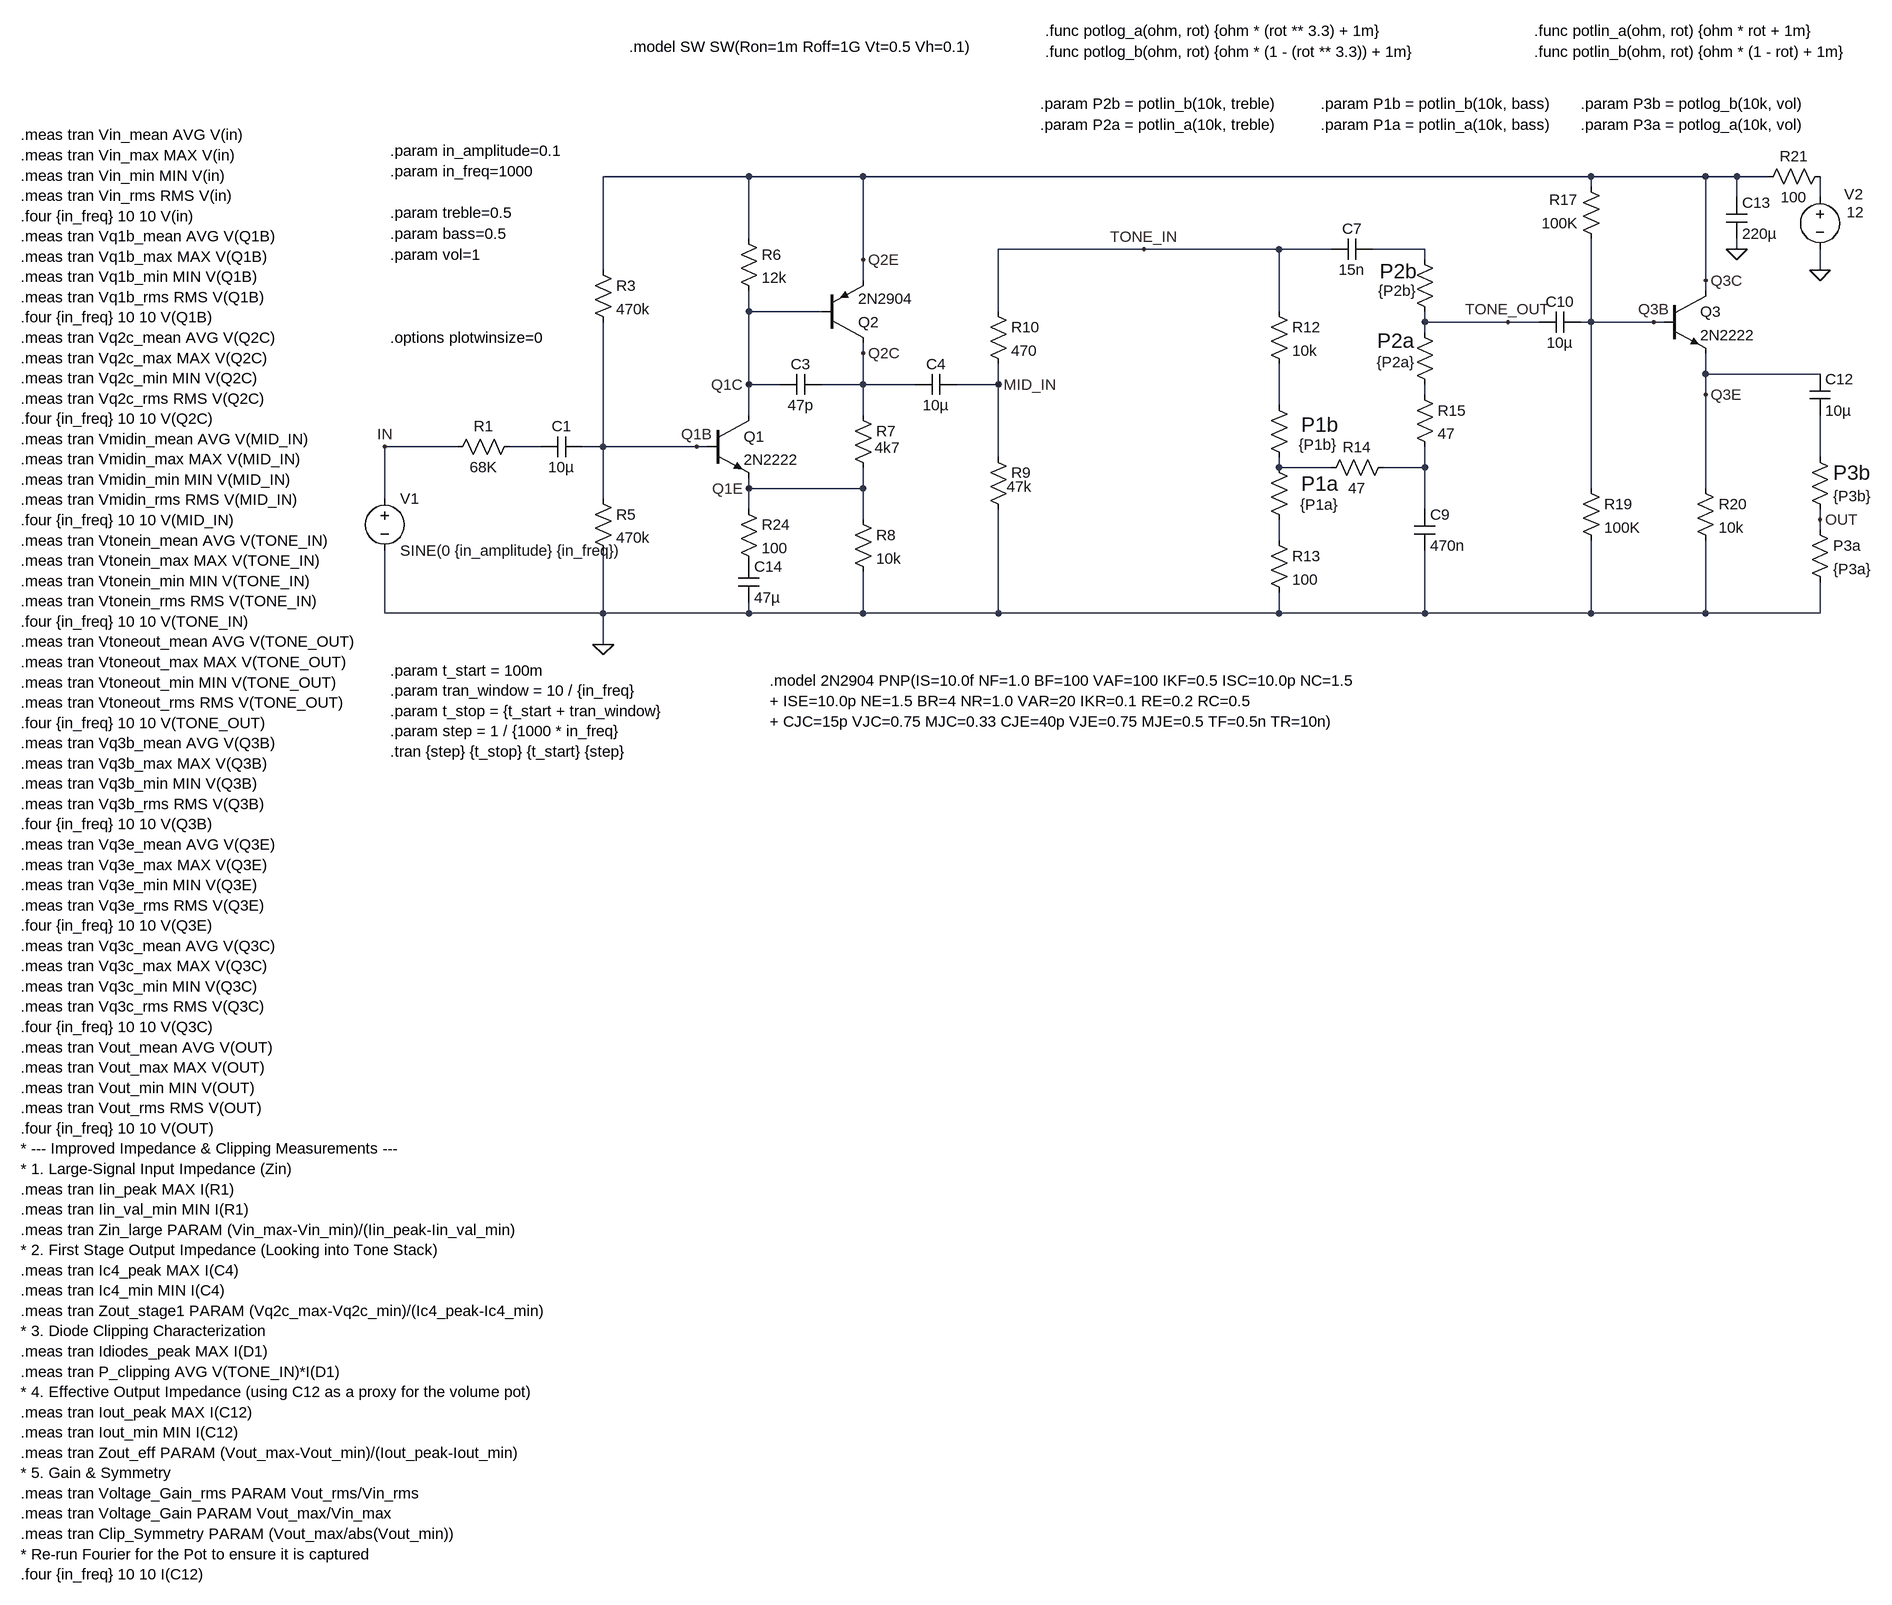
[diagram p0: schematic tataylino.asc]
tataylino.asc, the LTspice schematic file:
Version 4
SHEET 1 2228 1336
WIRE -160 -176 -384 -176
WIRE 16 -176 -160 -176
WIRE 1136 -176 16 -176
WIRE 1312 -176 1136 -176
WIRE 1360 -176 1312 -176
WIRE 1408 -176 1360 -176
WIRE 1136 -160 1136 -176
WIRE 1360 -144 1360 -176
WIRE 1488 -144 1488 -176
WIRE -160 -80 -160 -176
WIRE 448 -64 224 -64
WIRE 656 -64 448 -64
WIRE 736 -64 656 -64
WIRE 880 -64 800 -64
WIRE 1360 -64 1360 -80
WIRE 16 -48 16 -176
WIRE 880 -48 880 -64
WIRE -384 -32 -384 -176
WIRE 1488 -32 1488 -64
WIRE 16 -16 16 -48
WIRE 1312 -16 1312 -176
WIRE 1312 0 1312 -16
WIRE -160 32 -160 0
WIRE -48 32 -160 32
WIRE 224 32 224 -64
WIRE 656 32 656 -64
WIRE 880 48 880 32
WIRE 1008 48 880 48
WIRE 1056 48 1008 48
WIRE 1136 48 1136 -80
WIRE 1136 48 1120 48
WIRE 1232 48 1136 48
WIRE 1248 48 1232 48
WIRE 880 64 880 48
WIRE 16 96 16 80
WIRE 1312 128 1312 96
WIRE 1488 128 1312 128
WIRE -160 144 -160 32
WIRE -112 144 -160 144
WIRE 16 144 16 96
WIRE 16 144 -48 144
WIRE 96 144 16 144
WIRE 224 144 224 112
WIRE 224 144 160 144
WIRE 880 160 880 144
WIRE 1312 160 1312 128
WIRE 656 176 656 112
WIRE -160 192 -160 144
WIRE 16 192 16 144
WIRE -608 240 -720 240
WIRE -480 240 -528 240
WIRE -384 240 -384 48
WIRE -384 240 -416 240
WIRE -240 240 -384 240
WIRE -224 240 -240 240
WIRE 224 256 224 144
WIRE 1488 256 1488 192
WIRE 656 272 656 256
WIRE 736 272 656 272
WIRE 880 272 880 240
WIRE 880 272 816 272
WIRE -160 304 -160 288
WIRE 16 304 16 272
WIRE 16 304 -160 304
WIRE 1136 304 1136 48
WIRE 1312 304 1312 160
WIRE -720 320 -720 240
WIRE -384 320 -384 240
WIRE -160 336 -160 304
WIRE 880 336 880 272
WIRE 16 352 16 304
WIRE 1488 352 1488 336
WIRE 1488 368 1488 352
WIRE 656 384 656 352
WIRE -720 496 -720 400
WIRE -384 496 -384 400
WIRE -384 496 -720 496
WIRE -160 496 -160 480
WIRE -160 496 -384 496
WIRE 16 496 16 432
WIRE 16 496 -160 496
WIRE 224 496 224 336
WIRE 224 496 16 496
WIRE 656 496 656 464
WIRE 656 496 224 496
WIRE 880 496 880 400
WIRE 880 496 656 496
WIRE 1136 496 1136 384
WIRE 1136 496 880 496
WIRE 1312 496 1312 384
WIRE 1312 496 1136 496
WIRE 1488 496 1488 448
WIRE 1488 496 1312 496
WIRE -384 544 -384 496
FLAG 1488 -32 0
FLAG -240 240 Q1B
FLAG -160 144 Q1C
FLAG -160 304 Q1E
FLAG 16 96 Q2C
FLAG 16 -48 Q2E
FLAG 1232 48 Q3B
FLAG 1312 -16 Q3C
FLAG 1312 160 Q3E
FLAG 1488 352 OUT
FLAG -384 544 0
FLAG 224 144 MID_IN
FLAG -720 240 IN
FLAG 1360 -64 0
FLAG 1008 48 TONE_OUT
FLAG 448 -64 TONE_IN
DATAFLAG -384 80 "round($*100)/100"
DATAFLAG -336 240 "round($*100)/100"
DATAFLAG 16 144 "round($*100)/100"
DATAFLAG -160 32 "round($*100)/100"
DATAFLAG 16 -176 "$"
DATAFLAG 1136 -32 "round($*100)/100"
DATAFLAG 1184 48 "round($*100)/100"
DATAFLAG 1360 128 "round($*100)/100"
DATAFLAG 1312 -176 "$"
DATAFLAG -80 304 "round($*100)/100"
DATAFLAG 176 144 "round($*100)/100"
SYMBOL npn -224 192 R0
SYMATTR InstName Q1
SYMATTR Value 2N2222
SYMBOL npn 1248 0 R0
SYMATTR InstName Q3
SYMATTR Value 2N2222
SYMBOL Cap -48 128 R90
WINDOW 0 0 32 VBottom 2
WINDOW 3 32 32 VTop 2
SYMATTR InstName C3
SYMATTR Value 47p
SYMBOL Cap 160 128 R90
WINDOW 0 0 32 VBottom 2
WINDOW 3 32 32 VTop 2
SYMATTR InstName C4
SYMATTR Value 10µ
SYMBOL Res 0 176 R0
WINDOW 3 34 65 Left 2
SYMATTR Value 4k7
SYMATTR InstName R7
SYMBOL Res -400 -48 R0
SYMATTR InstName R3
SYMATTR Value 470k
SYMBOL Res -176 -96 R0
SYMATTR InstName R6
SYMATTR Value 12k
SYMBOL Res 208 16 R0
SYMATTR InstName R10
SYMATTR Value 470
SYMBOL Res 0 336 R0
SYMATTR InstName R8
SYMATTR Value 10k
SYMBOL Res 640 160 R0
WINDOW 0 50 46 Left 3
WINDOW 3 46 77 Left 2
SYMATTR InstName P1b
SYMATTR Value {P1b}
SYMBOL Res 640 256 R0
WINDOW 0 50 41 Left 3
WINDOW 3 48 73 Left 2
SYMATTR InstName P1a
SYMATTR Value {P1a}
SYMBOL Res 832 256 R90
WINDOW 0 0 56 VBottom 2
WINDOW 3 32 56 VTop 2
SYMATTR InstName R14
SYMATTR Value 47
SYMBOL Cap 800 -80 R90
WINDOW 0 0 32 VBottom 2
WINDOW 3 32 32 VTop 2
SYMATTR InstName C7
SYMATTR Value 15n
SYMBOL Res 864 -64 R0
WINDOW 3 -56 64 Left 2
WINDOW 0 -53 34 Left 3
SYMATTR Value {P2b}
SYMATTR InstName P2b
SYMBOL Res 864 48 R0
WINDOW 3 -58 62 Left 2
WINDOW 0 -57 29 Left 3
SYMATTR Value {P2a}
SYMATTR InstName P2a
SYMBOL Cap 864 336 R0
SYMATTR InstName C9
SYMATTR Value 470n
SYMBOL Cap 1120 32 R90
WINDOW 0 0 32 VBottom 2
WINDOW 3 32 32 VTop 2
SYMATTR InstName C10
SYMATTR Value 10µ
SYMBOL Res 1152 -64 R180
WINDOW 0 36 76 Left 2
WINDOW 3 36 40 Left 2
SYMATTR InstName R17
SYMATTR Value 100K
SYMBOL Res 1296 288 R0
SYMATTR InstName R20
SYMATTR Value 10k
SYMBOL Res -400 304 R0
SYMATTR InstName R5
SYMATTR Value 470k
SYMBOL Res 1120 288 R0
SYMATTR InstName R19
SYMATTR Value 100K
SYMBOL voltage 1488 -160 R0
WINDOW 0 37 11 Left 2
WINDOW 3 41 39 Left 2
SYMATTR InstName V2
SYMATTR Value 12
SYMBOL pnp -48 80 M180
SYMATTR InstName Q2
SYMATTR Value 2N2904
SYMBOL Res 1472 352 R0
SYMATTR InstName P3a
SYMATTR Value {P3a}
SYMBOL Res 1472 240 R0
WINDOW 0 36 40 Left 3
SYMATTR InstName P3b
SYMATTR Value {P3b}
SYMBOL Res 640 16 R0
SYMATTR InstName R12
SYMATTR Value 10k
SYMBOL Res 640 368 R0
SYMATTR InstName R13
SYMATTR Value 100
SYMBOL Res 864 144 R0
SYMATTR InstName R15
SYMATTR Value 47
SYMBOL Res 208 240 R0
WINDOW 3 29 61 Left 2
SYMATTR Value 47k
SYMATTR InstName R9
SYMBOL Res -512 224 R90
WINDOW 0 0 56 VBottom 2
WINDOW 3 32 56 VTop 2
SYMATTR InstName R1
SYMATTR Value 68K
SYMBOL Cap -416 224 R90
WINDOW 0 0 32 VBottom 2
WINDOW 3 32 32 VTop 2
SYMATTR InstName C1
SYMATTR Value 10µ
SYMBOL Res 1504 -192 R90
WINDOW 0 0 56 VBottom 2
WINDOW 3 32 56 VTop 2
SYMATTR InstName R21
SYMATTR Value 100
SYMBOL Cap 1344 -144 R0
SYMATTR InstName C13
SYMATTR Value 220µ
SYMBOL Voltage -720 304 R0
SYMATTR InstName V1
SYMATTR Value SINE(0 {in_amplitude} {in_freq})
SYMBOL Cap 1472 128 R0
SYMATTR InstName C12
SYMATTR Value 10µ
SYMBOL Res -176 320 R0
SYMATTR InstName R24
SYMATTR Value 100
SYMBOL Cap -176 416 R0
SYMATTR InstName C14
SYMATTR Value 47µ
TEXT -712 -120 Left 2 !.param treble=0.5
TEXT 296 -400 Left 2 !.func potlog_a(ohm, rot) {ohm * (rot ** 3.3) + 1m}
TEXT 288 -288 Left 2 !.param P2b = potlin_b(10k, treble)
TEXT 288 -256 Left 2 !.param P2a = potlin_a(10k, treble)
TEXT 720 -288 Left 2 !.param P1b = potlin_b(10k, bass)
TEXT 720 -256 Left 2 !.param P1a = potlin_a(10k, bass)
TEXT -712 -88 Left 2 !.param bass=0.5
TEXT 1120 -288 Left 2 !.param P3b = potlog_b(10k, vol)
TEXT 1120 -256 Left 2 !.param P3a = potlog_a(10k, vol)
TEXT -712 -56 Left 2 !.param vol=1
TEXT 296 -368 Left 2 !.func potlog_b(ohm, rot) {ohm * (1 - (rot ** 3.3)) + 1m}
TEXT 1048 -400 Left 2 !.func potlin_a(ohm, rot) {ohm * rot + 1m}
TEXT 1048 -368 Left 2 !.func potlin_b(ohm, rot) {ohm * (1 - rot) + 1m}
TEXT -344 -376 Left 2 !.model SW SW(Ron=1m Roff=1G Vt=0.5 Vh=0.1)
TEXT -712 -216 Left 2 !.param in_amplitude=0.1
TEXT -712 -184 Left 2 !.param in_freq=1000
TEXT -712 72 Left 2 !.options plotwinsize=0
TEXT -712 584 Left 2 !.param t_start = 100m\n.param tran_window = 10 / {in_freq}\n.param t_stop = {t_start + tran_window}\n.param step = 1 / {1000 * in_freq}\n.tran {step} {t_stop} {t_start} {step}
TEXT -1280 -240 Left 2 !.meas tran Vin_mean AVG V(in)\n.meas tran Vin_max MAX V(in)\n.meas tran Vin_min MIN V(in)\n.meas tran Vin_rms RMS V(in)\n.four {in_freq} 10 10 V(in)\n.meas tran Vq1b_mean AVG V(Q1B)\n.meas tran Vq1b_max MAX V(Q1B)\n.meas tran Vq1b_min MIN V(Q1B)\n.meas tran Vq1b_rms RMS V(Q1B)\n.four {in_freq} 10 10 V(Q1B)\n.meas tran Vq2c_mean AVG V(Q2C)\n.meas tran Vq2c_max MAX V(Q2C)\n.meas tran Vq2c_min MIN V(Q2C)\n.meas tran Vq2c_rms RMS V(Q2C)\n.four {in_freq} 10 10 V(Q2C)\n.meas tran Vmidin_mean AVG V(MID_IN)\n.meas tran Vmidin_max MAX V(MID_IN)\n.meas tran Vmidin_min MIN V(MID_IN)\n.meas tran Vmidin_rms RMS V(MID_IN)\n.four {in_freq} 10 10 V(MID_IN)\n.meas tran Vtonein_mean AVG V(TONE_IN)\n.meas tran Vtonein_max MAX V(TONE_IN)\n.meas tran Vtonein_min MIN V(TONE_IN)\n.meas tran Vtonein_rms RMS V(TONE_IN)\n.four {in_freq} 10 10 V(TONE_IN)\n.meas tran Vtoneout_mean AVG V(TONE_OUT)\n.meas tran Vtoneout_max MAX V(TONE_OUT)\n.meas tran Vtoneout_min MIN V(TONE_OUT)\n.meas tran Vtoneout_rms RMS V(TONE_OUT)\n.four {in_freq} 10 10 V(TONE_OUT)\n.meas tran Vq3b_mean AVG V(Q3B)\n.meas tran Vq3b_max MAX V(Q3B)\n.meas tran Vq3b_min MIN V(Q3B)\n.meas tran Vq3b_rms RMS V(Q3B)\n.four {in_freq} 10 10 V(Q3B)\n.meas tran Vq3e_mean AVG V(Q3E)\n.meas tran Vq3e_max MAX V(Q3E)\n.meas tran Vq3e_min MIN V(Q3E)\n.meas tran Vq3e_rms RMS V(Q3E)\n.four {in_freq} 10 10 V(Q3E)\n.meas tran Vq3c_mean AVG V(Q3C)\n.meas tran Vq3c_max MAX V(Q3C)\n.meas tran Vq3c_min MIN V(Q3C)\n.meas tran Vq3c_rms RMS V(Q3C)\n.four {in_freq} 10 10 V(Q3C)\n.meas tran Vout_mean AVG V(OUT)\n.meas tran Vout_max MAX V(OUT)\n.meas tran Vout_min MIN V(OUT)\n.meas tran Vout_rms RMS V(OUT)\n.four {in_freq} 10 10 V(OUT)\n* --- Improved Impedance & Clipping Measurements ---\n* 1. Large-Signal Input Impedance (Zin)\n.meas tran Iin_peak MAX I(R1)\n.meas tran Iin_val_min MIN I(R1)\n.meas tran Zin_large PARAM (Vin_max-Vin_min)/(Iin_peak-Iin_val_min)\n* 2. First Stage Output Impedance (Looking into Tone Stack)\n.meas tran Ic4_peak MAX I(C4)\n.meas tran Ic4_min MIN I(C4)\n.meas tran Zout_stage1 PARAM (Vq2c_max-Vq2c_min)/(Ic4_peak-Ic4_min)\n* 3. Diode Clipping Characterization\n.meas tran Idiodes_peak MAX I(D1)\n.meas tran P_clipping AVG V(TONE_IN)*I(D1)\n* 4. Effective Output Impedance (using C12 as a proxy for the volume pot)\n.meas tran Iout_peak MAX I(C12)\n.meas tran Iout_min MIN I(C12)\n.meas tran Zout_eff PARAM (Vout_max-Vout_min)/(Iout_peak-Iout_min)\n* 5. Gain & Symmetry\n.meas tran Voltage_Gain_rms PARAM Vout_rms/Vin_rms\n.meas tran Voltage_Gain PARAM Vout_max/Vin_max\n.meas tran Clip_Symmetry PARAM (Vout_max/abs(Vout_min))\n* Re-run Fourier for the Pot to ensure it is captured\n.four {in_freq} 10 10 I(C12)
TEXT -128 600 Left 2 !.model 2N2904 PNP(IS=10.0f NF=1.0 BF=100 VAF=100 IKF=0.5 ISC=10.0p NC=1.5\n+ ISE=10.0p NE=1.5 BR=4 NR=1.0 VAR=20 IKR=0.1 RE=0.2 RC=0.5\n+ CJC=15p VJC=0.75 MJC=0.33 CJE=40p VJE=0.75 MJE=0.5 TF=0.5n TR=10n)

The netlist it stands for:
* tataylino.asc
Q1 Q1C Q1B Q1E 0 2N2222
Q3 Q3C Q3B Q3E 0 2N2222
C3 Q2C Q1C 47p
C4 MID_IN Q2C 10µ
R7 Q2C Q1E 4k7
R3 Q3C Q1B 470k
R6 Q3C Q1C 12k
R10 TONE_IN MID_IN 470
R8 Q1E 0 10k
R§P1b N004 N007 {P1b}
R§P1a N007 N009 {P1a}
R14 N008 N007 47
C7 N002 TONE_IN 15n
R§P2b N002 TONE_OUT {P2b}
R§P2a TONE_OUT N003 {P2a}
C9 N008 0 470n
C10 Q3B TONE_OUT 10µ
R17 Q3B Q3C 100K
R20 Q3E 0 10k
R5 Q1B 0 470k
R19 Q3B 0 100K
V2 N001 0 12
Q2 Q2C Q1C Q3C 0 2N2904
R§P3a OUT 0 {P3a}
R§P3b N006 OUT {P3b}
R12 TONE_IN N004 10k
R13 N009 0 100
R15 N003 N008 47
R9 MID_IN 0 47k
R1 N005 IN 68K
C1 Q1B N005 10µ
R21 N001 Q3C 100
C13 Q3C 0 220µ
V1 IN 0 SINE(0 {in_amplitude} {in_freq})
C12 Q3E N006 10µ
R24 Q1E P001 100
C14 P001 0 47µ
.model NPN NPN
.model PNP PNP
.lib standard.bjt
.param treble=0.5
.func potlog_a(ohm, rot) {ohm * (rot ** 3.3) + 1m}
.param P2b = potlin_b(10k, treble)
.param P2a = potlin_a(10k, treble)
.param P1b = potlin_b(10k, bass)
.param P1a = potlin_a(10k, bass)
.param bass=0.5
.param P3b = potlog_b(10k, vol)
.param P3a = potlog_a(10k, vol)
.param vol=1
.func potlog_b(ohm, rot) {ohm * (1 - (rot ** 3.3)) + 1m}
.func potlin_a(ohm, rot) {ohm * rot + 1m}
.func potlin_b(ohm, rot) {ohm * (1 - rot) + 1m}
.model SW SW(Ron=1m Roff=1G Vt=0.5 Vh=0.1)
.param in_amplitude=0.1
.param in_freq=1000
.options plotwinsize=0
.param t_start = 100m
.param tran_window = 10 / {in_freq}
.param t_stop = {t_start + tran_window}
.param step = 1 / {1000 * in_freq}
.tran {step} {t_stop} {t_start} {step}
.meas tran Vin_mean AVG V(in)
.meas tran Vin_max MAX V(in)
.meas tran Vin_min MIN V(in)
.meas tran Vin_rms RMS V(in)
.four {in_freq} 10 10 V(in)
.meas tran Vq1b_mean AVG V(Q1B)
.meas tran Vq1b_max MAX V(Q1B)
.meas tran Vq1b_min MIN V(Q1B)
.meas tran Vq1b_rms RMS V(Q1B)
.four {in_freq} 10 10 V(Q1B)
.meas tran Vq2c_mean AVG V(Q2C)
.meas tran Vq2c_max MAX V(Q2C)
.meas tran Vq2c_min MIN V(Q2C)
.meas tran Vq2c_rms RMS V(Q2C)
.four {in_freq} 10 10 V(Q2C)
.meas tran Vmidin_mean AVG V(MID_IN)
.meas tran Vmidin_max MAX V(MID_IN)
.meas tran Vmidin_min MIN V(MID_IN)
.meas tran Vmidin_rms RMS V(MID_IN)
.four {in_freq} 10 10 V(MID_IN)
.meas tran Vtonein_mean AVG V(TONE_IN)
.meas tran Vtonein_max MAX V(TONE_IN)
.meas tran Vtonein_min MIN V(TONE_IN)
.meas tran Vtonein_rms RMS V(TONE_IN)
.four {in_freq} 10 10 V(TONE_IN)
.meas tran Vtoneout_mean AVG V(TONE_OUT)
.meas tran Vtoneout_max MAX V(TONE_OUT)
.meas tran Vtoneout_min MIN V(TONE_OUT)
.meas tran Vtoneout_rms RMS V(TONE_OUT)
.four {in_freq} 10 10 V(TONE_OUT)
.meas tran Vq3b_mean AVG V(Q3B)
.meas tran Vq3b_max MAX V(Q3B)
.meas tran Vq3b_min MIN V(Q3B)
.meas tran Vq3b_rms RMS V(Q3B)
.four {in_freq} 10 10 V(Q3B)
.meas tran Vq3e_mean AVG V(Q3E)
.meas tran Vq3e_max MAX V(Q3E)
.meas tran Vq3e_min MIN V(Q3E)
.meas tran Vq3e_rms RMS V(Q3E)
.four {in_freq} 10 10 V(Q3E)
.meas tran Vq3c_mean AVG V(Q3C)
.meas tran Vq3c_max MAX V(Q3C)
.meas tran Vq3c_min MIN V(Q3C)
.meas tran Vq3c_rms RMS V(Q3C)
.four {in_freq} 10 10 V(Q3C)
.meas tran Vout_mean AVG V(OUT)
.meas tran Vout_max MAX V(OUT)
.meas tran Vout_min MIN V(OUT)
.meas tran Vout_rms RMS V(OUT)
.four {in_freq} 10 10 V(OUT)
* --- Improved Impedance & Clipping Measurements ---
* 1. Large-Signal Input Impedance (Zin)
.meas tran Iin_peak MAX I(R1)
.meas tran Iin_val_min MIN I(R1)
.meas tran Zin_large PARAM (Vin_max-Vin_min)/(Iin_peak-Iin_val_min)
* 2. First Stage Output Impedance (Looking into Tone Stack)
.meas tran Ic4_peak MAX I(C4)
.meas tran Ic4_min MIN I(C4)
.meas tran Zout_stage1 PARAM (Vq2c_max-Vq2c_min)/(Ic4_peak-Ic4_min)
* 3. Diode Clipping Characterization
.meas tran Idiodes_peak MAX I(D1)
.meas tran P_clipping AVG V(TONE_IN)*I(D1)
* 4. Effective Output Impedance (using C12 as a proxy for the volume pot)
.meas tran Iout_peak MAX I(C12)
.meas tran Iout_min MIN I(C12)
.meas tran Zout_eff PARAM (Vout_max-Vout_min)/(Iout_peak-Iout_min)
* 5. Gain & Symmetry
.meas tran Voltage_Gain_rms PARAM Vout_rms/Vin_rms
.meas tran Voltage_Gain PARAM Vout_max/Vin_max
.meas tran Clip_Symmetry PARAM (Vout_max/abs(Vout_min))
* Re-run Fourier for the Pot to ensure it is captured
.four {in_freq} 10 10 I(C12)
.model 2N2904 PNP(IS=10.0f NF=1.0 BF=100 VAF=100 IKF=0.5 ISC=10.0p NC=1.5
+ ISE=10.0p NE=1.5 BR=4 NR=1.0 VAR=20 IKR=0.1 RE=0.2 RC=0.5
+ CJC=15p VJC=0.75 MJC=0.33 CJE=40p VJE=0.75 MJE=0.5 TF=0.5n TR=10n)
.backanno
.end